# EAGLE design senzor (EAGLE 7.0.0)
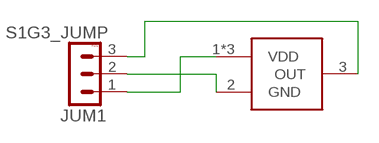
[diagram p0: schematic, sheet 1]

## Parts
JUM1  S1G3_JUMP  [S1G3_JUM]
U$1  LMT87  [SC70]

## Nets
GND: JUM1.2 U$1.2(GND)
N$2: JUM1.3 U$1.3(OUT)
VDD: JUM1.1 U$1.1(VDD) U$1.4(VDD) U$1.5(VDD)

## Library data of the parts
JUM1 = #PaJa_konektory:S1G3_JUMP: Radove konektory - koliky - 3x
U$1 = kumen:LMT87

## Board
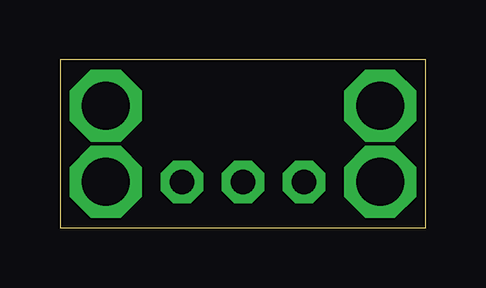
[diagram p1: board, top side]
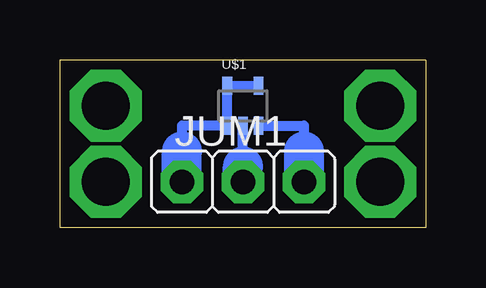
[diagram p2: board, bottom side, seen from below]

Size 15.24 x 6.99 mm. Coordinates in mm from the lower left corner, seen from the top.
Outline: 0,6.97 0,0 15.24,0 15.24,6.99 0,6.99
Copper layers (1*16): Top 0.035mm / dielectric 1.5mm / Bottom 0.035mm
Design rules "default": minimum track width 10mil, minimum drill 24mil, track to track 8mil, track to pad 8mil, pad to pad 8mil, via to via 8mil, smd to smd 8mil, copper to edge 40mil, drill to drill 8mil, minimum pad ring 10mil, minimum via ring 8mil, stop-mask expansion 4mil, vias tented up to drill 0mil, thermal gap 10mil

### Footprints (pad centres in the part's own frame; a part is rotated, then mirrored left to right if it is on the bottom)
S1G3_JUM = drill 1.016 pad 1.778 octagon: 1 -2.54,0; 2 0,0; 3 2.54,0
SC70 = smd 0.4 x 0.75: 1 -0.65,-0.825; 2 0,-0.825; 3 0.65,-0.825; 4 0.65,0.825; 5 -0.65,0.825

### Placement (x,y rotation side)
JUM1  7.62,1.91 0 bottom
U$1  7.62,5.08 0 bottom

### Tracks (layer width: path | path; a pad name or v marks a point on that pad's centre or on a via)
GND
  Bottom 0.406: 7.62,2.54 U$1.2
  Bottom 1.676: JUM1.2 7.62,2.54
N$1  (via drill 2 pad 2.18)
  other vias: 1.91,5.08 1.91,1.91 13.34,1.91 13.34,5.08
N$2
  Bottom 0.406: U$1.3 5.08,4.25 5.08,3.17
  Bottom 1.676: 5.08,3.17 JUM1.3
VDD
  Bottom 0.406: U$1.4 U$1.5 U$1.1 10.16,4.25 10.16,3.17
  Bottom 1.676: JUM1.1 10.16,3.17